# EAGLE design OBS-buttons-buttons (EAGLE 7.7.0)
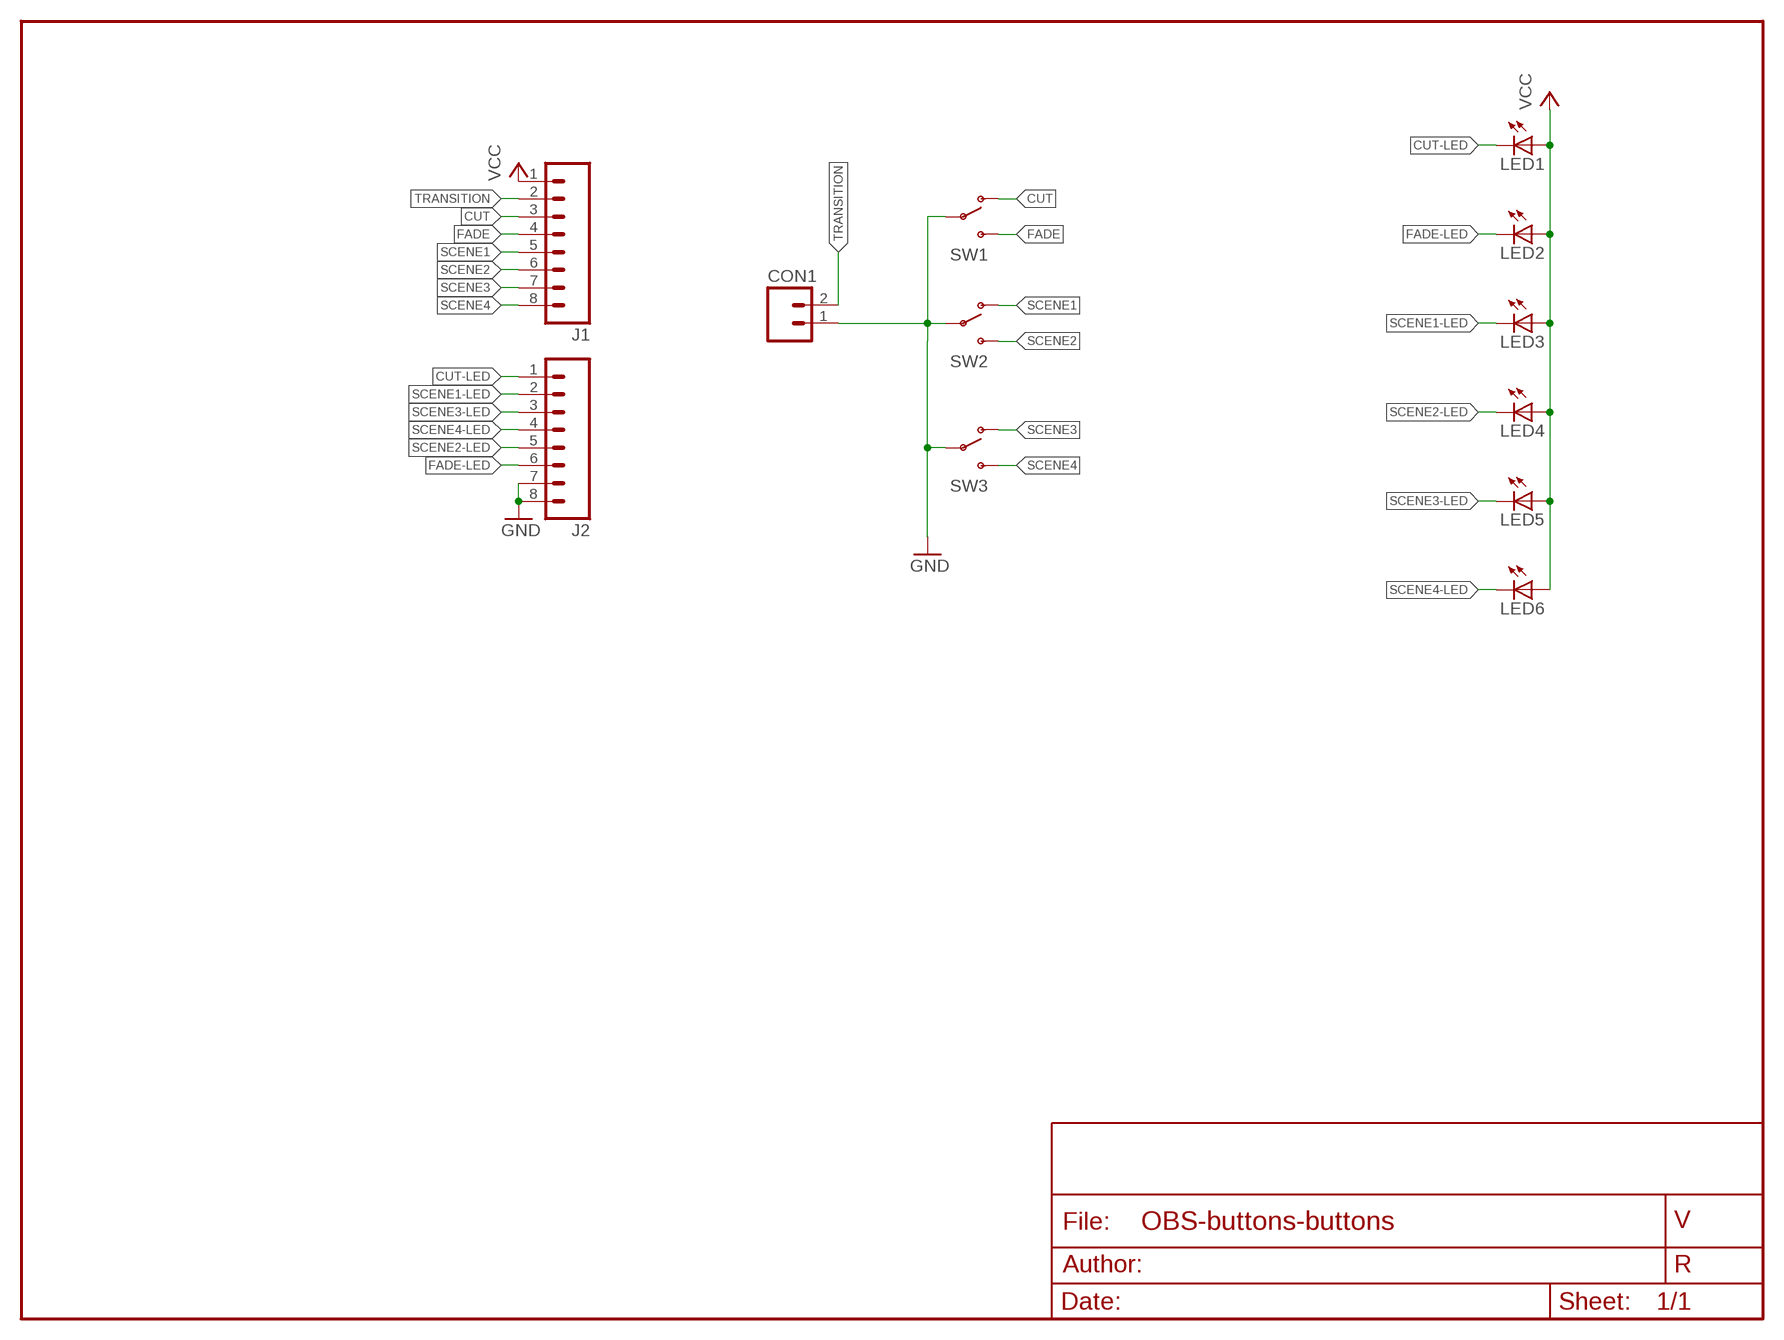
[diagram p0: schematic, sheet 1]

## Parts
CON1  CONNECTOR-M02508-LOCK  [MSTB2]
J1  CONNECTOR-M08LOCK  [1X08_LOCK]
J2  CONNECTOR-M08LOCK  [1X08_LOCK]
LED1  LEDLED5MM  [LED5MM]
LED2  LEDLED5MM  [LED5MM]
LED3  LEDLED5MM  [LED5MM]
LED4  LEDLED5MM  [LED5MM]
LED5  LEDLED5MM  [LED5MM]
LED6  LEDLED5MM  [LED5MM]
SW1  SWITCH-SPSTPTH-508  [SWITCH-SPDT-508]
SW2  SWITCH-SPSTPTH-508  [SWITCH-SPDT-508]
SW3  SWITCH-SPSTPTH-508  [SWITCH-SPDT-508]

## Nets
CUT: J1.3 SW1.1(O)
CUT-LED: J2.1 LED1.K(C)
FADE: J1.4 SW1.3(S)
FADE-LED: J2.6 LED2.K(C)
GND: CON1.1(A) J2.7 J2.8 SW1.2(P) SW2.2(P) SW3.2(P)
SCENE1: J1.5 SW2.1(O)
SCENE1-LED: J2.2 LED3.K(C)
SCENE2: J1.6 SW2.3(S)
SCENE2-LED: J2.5 LED4.K(C)
SCENE3: J1.7 SW3.1(O)
SCENE3-LED: J2.3 LED5.K(C)
SCENE4: J1.8 SW3.3(S)
SCENE4-LED: J2.4 LED6.K(C)
TRANSITION: CON1.2(B) J1.2
VCC: J1.1 LED1.A LED2.A LED3.A LED4.A LED5.A LED6.A

## Library data of the parts
CON1 = SPCoast:CONNECTOR-M02: PHOENIX CONNECTOR
J1 J2 = SPCoast:CONNECTOR-M08: Header 8 Standard 8-pin 0.1" header. Use with straight break away headers (SKU : PRT-00116), right angle break away headers (PRT-00553), swiss pins (PRT-00743), machine pins (PRT-00117), and female headers (PRT-00115).
LED1-LED6 = SPCoast:LED*
SW1-SW3 = SPCoast:SWITCH-SPST: SPST Switch Simple slide switch. Spark Fun Electronics SKU : COM-00102

## Board
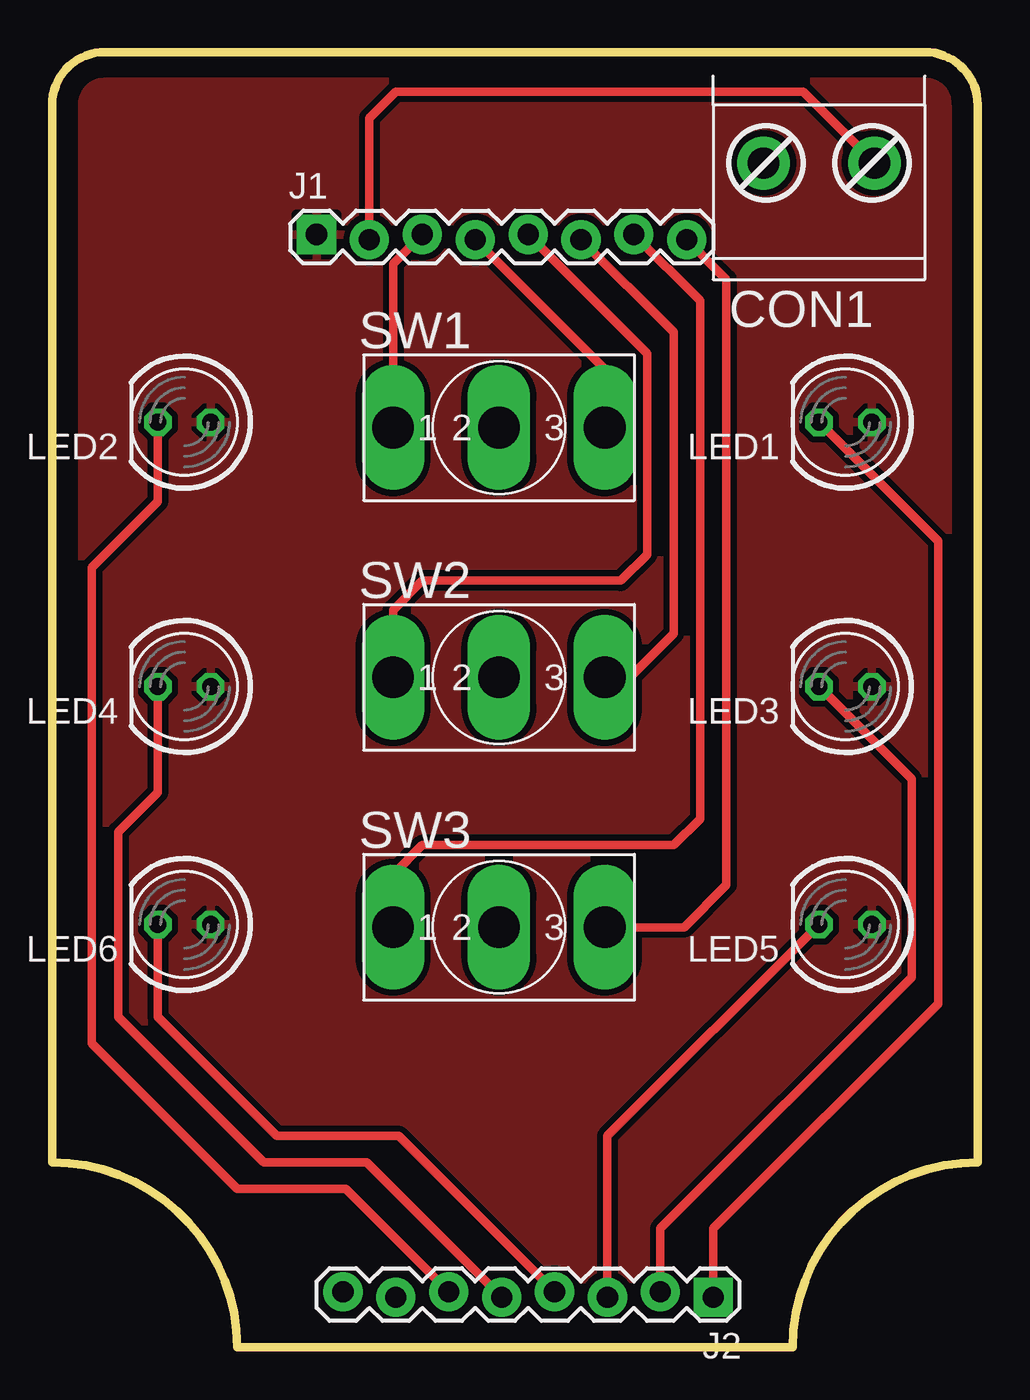
[diagram p1: board, top side]
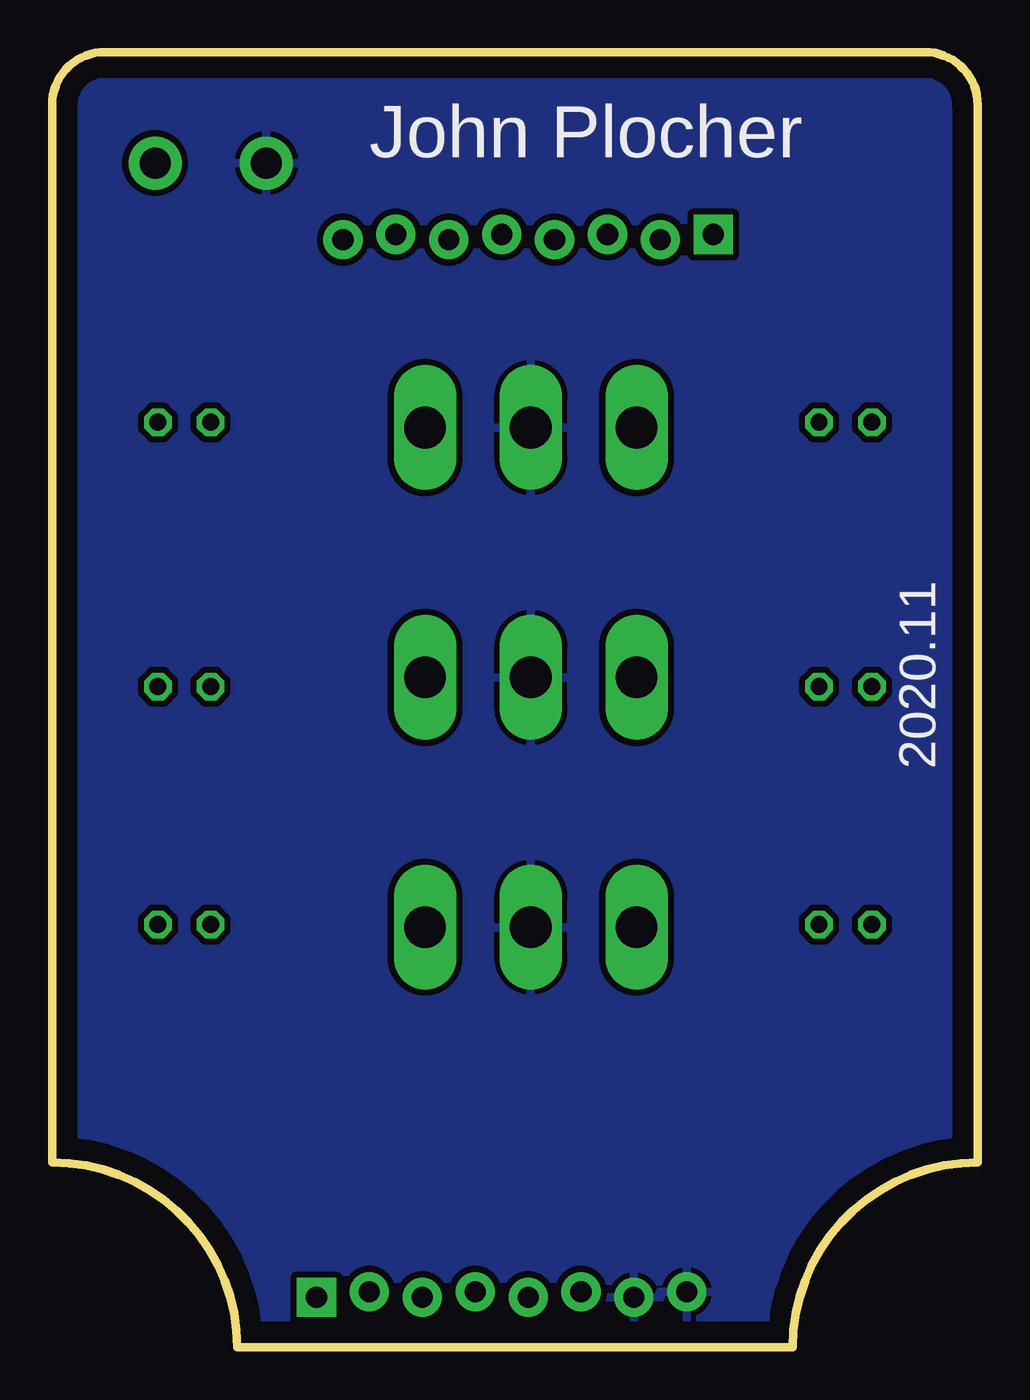
[diagram p2: board, bottom side, seen from below]

Size 44.45 x 62.23 mm. Coordinates in mm from the lower left corner, seen from the top.
Outline: 0,8.89 arc-90 8.89,0 35.56,0 arc-90 44.45,8.89 44.45,59.69 arc90 41.91,62.23 2.54,62.23 arc90 0,59.69 0,8.89
Copper layers (1*16): Top 0.035mm / dielectric 1.5mm / Bottom 0.035mm
Design rules "default": minimum track width 10mil, minimum drill 0.6mm, track to track 8mil, track to pad 8mil, pad to pad 8mil, via to via 8mil, smd to smd 8mil, copper to edge 40mil, drill to drill 8mil, minimum pad ring 10mil, minimum via ring 8mil, stop-mask expansion 4mil, vias tented up to drill 0mil, thermal gap 10mil

### Footprints (pad centres in the part's own frame; a part is rotated, then mirrored left to right if it is on the bottom)
MSTB2 = drill 1.5 pad 2.54: 1 -2.667,1.016; 2 2.667,1.016
1X08_LOCK = drill 1.016 pad 1.88 square: 1 0,0.127 | drill 1.016 pad 1.88: 2 2.54,-0.127; 3 5.08,0.127; 4 7.62,-0.127; 5 10.16,0.127; 6 12.7,-0.127; 7 15.24,0.127; 8 17.78,-0.127
LED5MM = drill 0.813 octagon: A 1.27,0; K -1.27,0
SWITCH-SPDT-508 = drill 2 long: 1 -5.08,0; 2 0,0; 3 5.08,0

### Placement (x,y rotation side)
CON1  36.83,55.88 0 top
J1  12.7,53.34 0 top
J2  31.75,2.54 180 top
LED1  38.1,44.45 0 top
LED2  6.35,44.45 0 top
LED3  38.1,31.75 0 top
LED4  6.35,31.75 0 top
LED5  38.1,20.32 0 top
LED6  6.35,20.32 0 top
SW1  21.46,44.19 0 top
SW2  21.46,32.19 0 top
SW3  21.46,20.19 0 top

### Tracks (layer width: path | path; a pad name or v marks a point on that pad's centre or on a via)
CUT
  Top 0.406: J1.3 16.38,52.07 SW1.1
CUT-LED
  Top 0.406: LED1.K 42.55,38.73 42.55,16.51 31.75,5.71 J2.1
FADE
  Top 0.406: J1.4 26.54,46.99 SW1.3
FADE-LED
  Top 0.406: LED2.K 5.08,40.64 1.91,37.46 1.91,14.6 8.89,7.62 14.1,7.62 J2.6
GND
  pour Bottom (isolate 0.305): 0,59.69 0,2.54 arc90 2.54,0 41.91,0 arc90 44.45,2.54 44.45,59.69 arc90 41.91,62.23 2.54,62.23 arc90
SCENE1
  Top 0.406: J1.5 28.57,47.75 28.57,38.1 27.3,36.83 17.78,36.83 16.38,35.43 SW2.1
SCENE1-LED
  Top 0.406: LED3.K 41.27,27.3 41.27,17.78 29.21,5.71 J2.2
SCENE2
  Top 0.406: J1.6 29.84,48.77 29.84,34.29 27.75,32.19 SW2.3
SCENE2-LED
  Top 0.406: LED4.K 5.08,26.67 3.17,24.77 3.17,15.87 10.16,8.89 15.11,8.89 J2.5
SCENE3
  Top 0.406: J1.7 31.12,50.29 31.12,25.4 29.84,24.13 17.78,24.13 16.38,22.73 SW3.1
SCENE3-LED
  Top 0.406: LED5.K 26.67,10.16 J2.3
SCENE4
  Top 0.406: J1.8 32.38,51.31 32.38,22.23 30.35,20.19 SW3.3
SCENE4-LED
  Top 0.406: LED6.K 5.08,15.87 10.8,10.16 16.64,10.16 J2.4
TRANSITION
  Top 0.406: CON1.2 36.07,60.33 16.51,60.33 15.24,59.05 J1.2
VCC
  pour Top (isolate 0.305): 0,59.69 0,2.54 arc90 2.54,0 41.91,0 arc90 44.45,2.54 44.45,59.69 arc90 41.91,62.23 2.54,62.23 arc90

### Text on the board
bPlace: John Plocher | 2020.11